# Altium schematic sheet FPGA_MISC.SchDoc
size 558 x 431 mm; SheetNumber: 8; SheetTotal: 25; Sheet_Name: FPGA MISCELLANEOUS; Size: 11x17
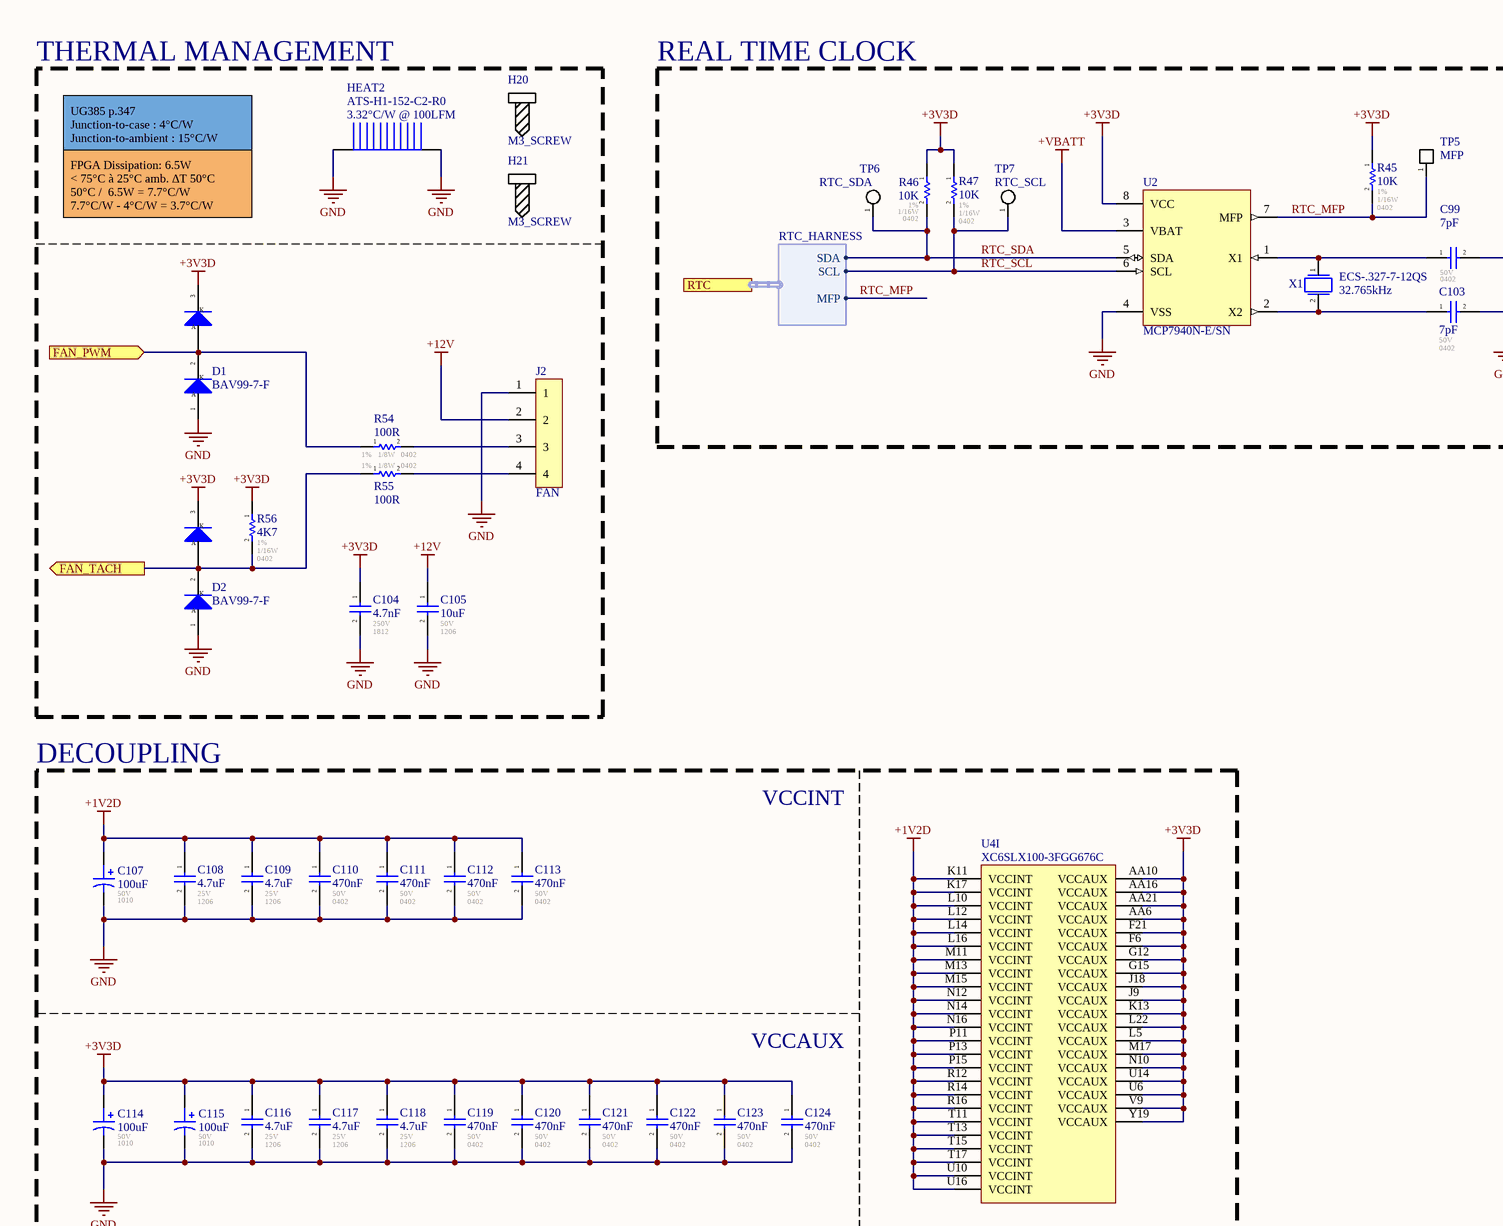
[diagram p0: FPGA_MISC.SchDoc, top left]
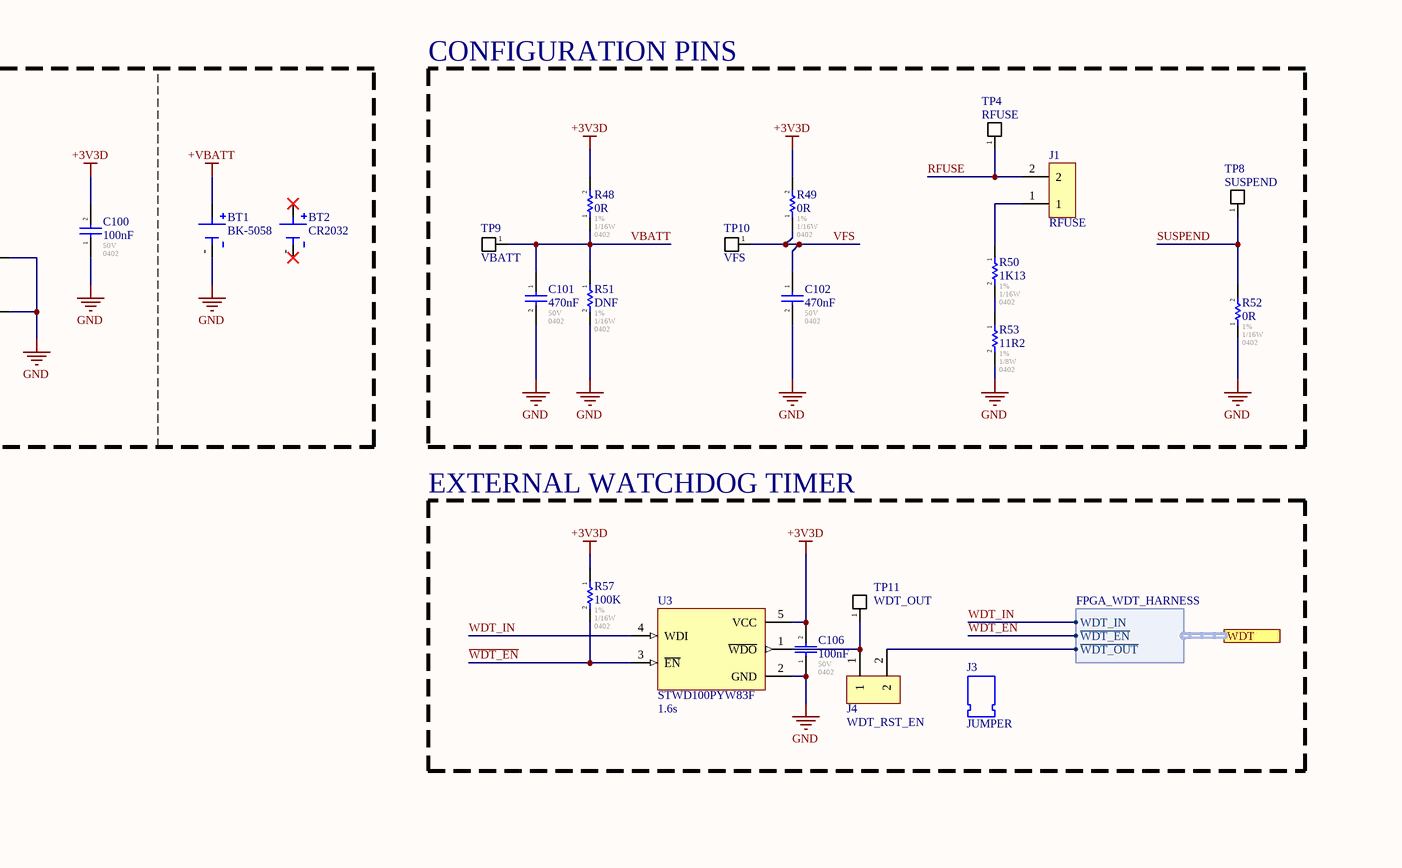
[diagram p1: FPGA_MISC.SchDoc, top right]
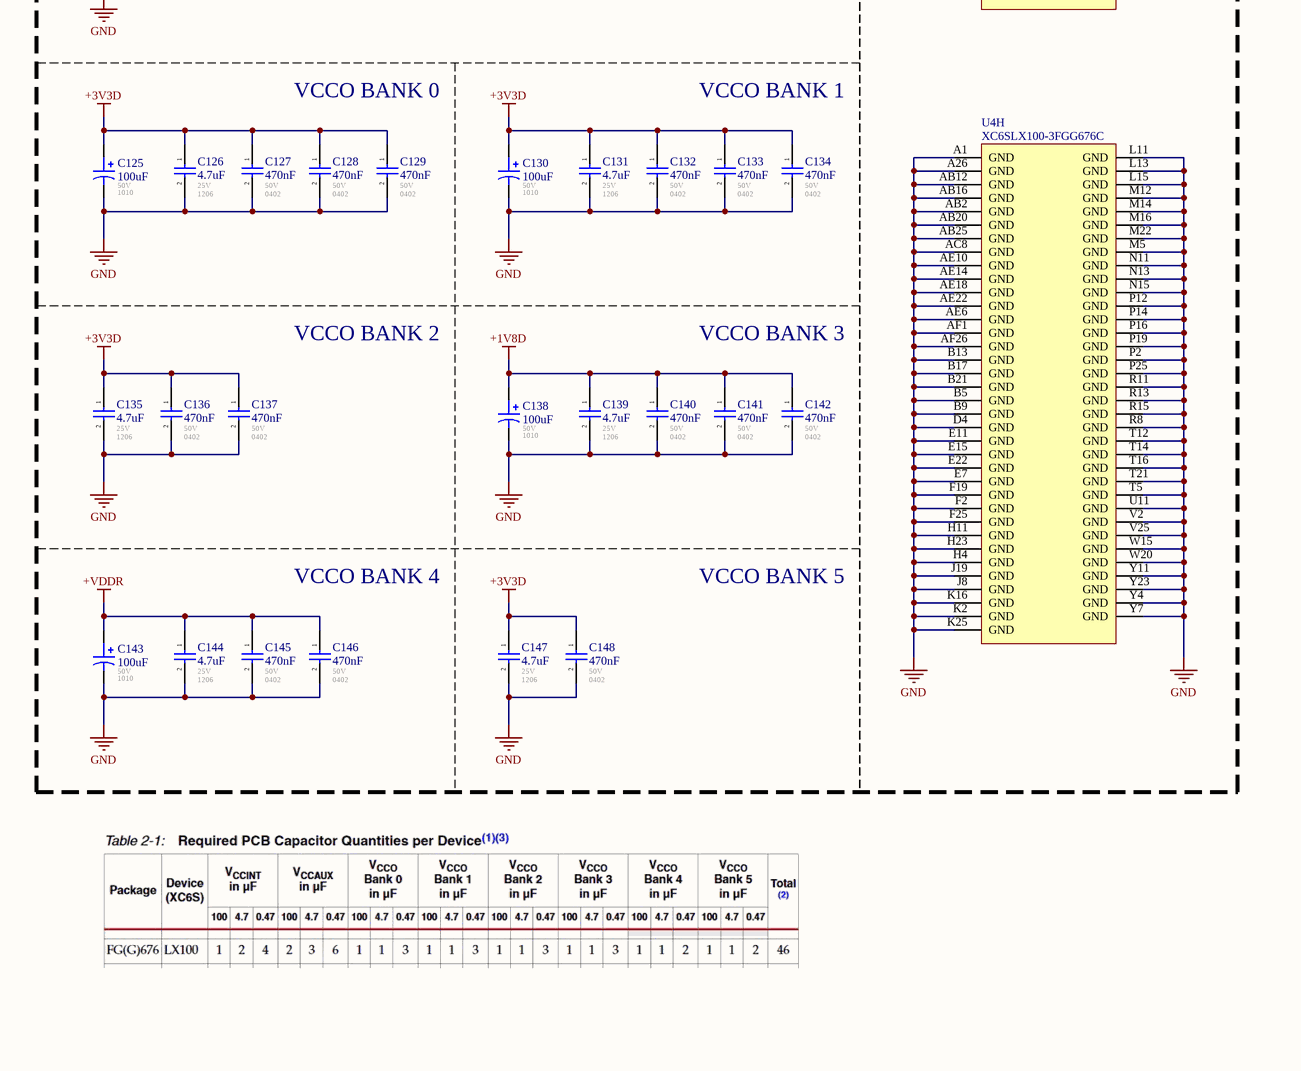
[diagram p2: FPGA_MISC.SchDoc, bottom left]
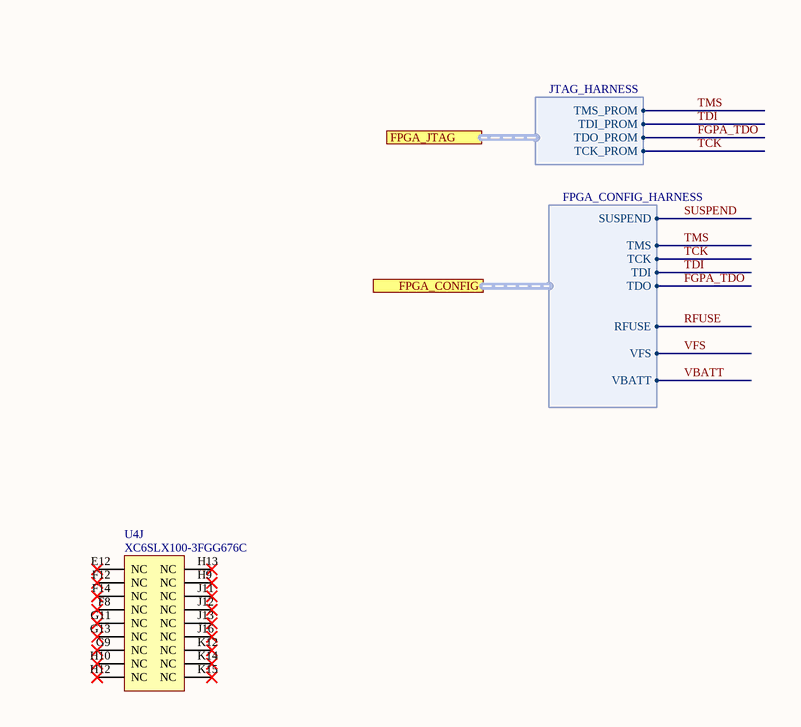
[diagram p3: FPGA_MISC.SchDoc, bottom right]

## Parts
BT1  BK-5058  [BK-5058]
BT2  CR2032  (mechanical)
C99  7pF  Voltage - Rated: 50V  Footprint: 0402  [CAP_0402]
C100  100nF  Voltage - Rated: 50V  Footprint: 0402  [CAP_0402]
C101  470nF  Voltage - Rated: 50V  Footprint: 0402  [CAP_0402]
C102  470nF  Voltage - Rated: 50V  Footprint: 0402  [CAP_0402]
C103  7pF  Voltage - Rated: 50V  Footprint: 0402  [CAP_0402]
C104  4.7nF  Voltage - Rated: 250V  Footprint: 1812  [CAP_1812]
C105  10uF  Voltage - Rated: 50V  Footprint: 1206  [CAP_1206]
C106  100nF  Voltage - Rated: 50V  Footprint: 0402  [CAP_0402]
C107  value 100uF  Voltage: 50V  Package: 1010  [CAP_ALU_1010_vishay]  (hidden comment: MAL215099101E3)
C108  4.7uF  Voltage - Rated: 25V  Footprint: 1206  [CAP_1206]
C109  4.7uF  Voltage - Rated: 25V  Footprint: 1206  [CAP_1206]
C110  470nF  Voltage - Rated: 50V  Footprint: 0402  [CAP_0402]
C111  470nF  Voltage - Rated: 50V  Footprint: 0402  [CAP_0402]
C112  470nF  Voltage - Rated: 50V  Footprint: 0402  [CAP_0402]
C113  470nF  Voltage - Rated: 50V  Footprint: 0402  [CAP_0402]
C114  value 100uF  Voltage: 50V  Package: 1010  [CAP_ALU_1010_vishay]  (hidden comment: MAL215099101E3)
C115  value 100uF  Voltage: 50V  Package: 1010  [CAP_ALU_1010_vishay]  (hidden comment: MAL215099101E3)
C116  4.7uF  Voltage - Rated: 25V  Footprint: 1206  [CAP_1206]
C117  4.7uF  Voltage - Rated: 25V  Footprint: 1206  [CAP_1206]
C118  4.7uF  Voltage - Rated: 25V  Footprint: 1206  [CAP_1206]
C119  470nF  Voltage - Rated: 50V  Footprint: 0402  [CAP_0402]
C120  470nF  Voltage - Rated: 50V  Footprint: 0402  [CAP_0402]
C121  470nF  Voltage - Rated: 50V  Footprint: 0402  [CAP_0402]
C122  470nF  Voltage - Rated: 50V  Footprint: 0402  [CAP_0402]
C123  470nF  Voltage - Rated: 50V  Footprint: 0402  [CAP_0402]
C124  470nF  Voltage - Rated: 50V  Footprint: 0402  [CAP_0402]
C125  value 100uF  Voltage: 50V  Package: 1010  [CAP_ALU_1010_vishay]  (hidden comment: MAL215099101E3)
C126  4.7uF  Voltage - Rated: 25V  Footprint: 1206  [CAP_1206]
C127  470nF  Voltage - Rated: 50V  Footprint: 0402  [CAP_0402]
C128  470nF  Voltage - Rated: 50V  Footprint: 0402  [CAP_0402]
C129  470nF  Voltage - Rated: 50V  Footprint: 0402  [CAP_0402]
C130  value 100uF  Voltage: 50V  Package: 1010  [CAP_ALU_1010_vishay]  (hidden comment: MAL215099101E3)
C131  4.7uF  Voltage - Rated: 25V  Footprint: 1206  [CAP_1206]
C132  470nF  Voltage - Rated: 50V  Footprint: 0402  [CAP_0402]
C133  470nF  Voltage - Rated: 50V  Footprint: 0402  [CAP_0402]
C134  470nF  Voltage - Rated: 50V  Footprint: 0402  [CAP_0402]
C135  4.7uF  Voltage - Rated: 25V  Footprint: 1206  [CAP_1206]
C136  470nF  Voltage - Rated: 50V  Footprint: 0402  [CAP_0402]
C137  470nF  Voltage - Rated: 50V  Footprint: 0402  [CAP_0402]
C138  value 100uF  Voltage: 50V  Package: 1010  [CAP_ALU_1010_vishay]  (hidden comment: MAL215099101E3)
C139  4.7uF  Voltage - Rated: 25V  Footprint: 1206  [CAP_1206]
C140  470nF  Voltage - Rated: 50V  Footprint: 0402  [CAP_0402]
C141  470nF  Voltage - Rated: 50V  Footprint: 0402  [CAP_0402]
C142  470nF  Voltage - Rated: 50V  Footprint: 0402  [CAP_0402]
C143  value 100uF  Voltage: 50V  Package: 1010  [CAP_ALU_1010_vishay]  (hidden comment: MAL215099101E3)
C144  4.7uF  Voltage - Rated: 25V  Footprint: 1206  [CAP_1206]
C145  470nF  Voltage - Rated: 50V  Footprint: 0402  [CAP_0402]
C146  470nF  Voltage - Rated: 50V  Footprint: 0402  [CAP_0402]
C147  4.7uF  Voltage - Rated: 25V  Footprint: 1206  [CAP_1206]
C148  470nF  Voltage - Rated: 50V  Footprint: 0402  [CAP_0402]
D1  BAV99-7-F  [SOT23-3]
D2  BAV99-7-F  [SOT23-3]
H20  M3_SCREW  (mechanical)
H21  M3_SCREW  (mechanical)
HEAT2  ATS-H1-152-C2-R0  Thermal Resistance: 3.32°C/W @ 100LFM  [ATS-H1-152-C2-R0]
J1  RFUSE  [HEADER-2_100MIL]
J2  FAN  [FAN_HEADER-4]
J3  JUMPER  (mechanical)
J4  WDT_RST_EN  [HEADER-2_100MIL]
R45  10K  Tolerance: 1%  Power: 1/16W  Package / Case: 0402  [RES_0402]
R46  10K  Tolerance: 1%  Power: 1/16W  Package / Case: 0402  [RES_0402]
R47  10K  Tolerance: 1%  Power: 1/16W  Package / Case: 0402  [RES_0402]
R48  0R  Tolerance: 1%  Power: 1/16W  Package / Case: 0402  [RES_0402]
R49  0R  Tolerance: 1%  Power: 1/16W  Package / Case: 0402  [RES_0402]
R50  1K13  Tolerance: 1%  Power: 1/16W  Package / Case: 0402  [RES_0402]
R51  DNF  Tolerance: 1%  Power: 1/16W  Package / Case: 0402  [RES_0402]
R52  0R  Tolerance: 1%  Power: 1/16W  Package / Case: 0402  [RES_0402]
R53  11R2  Tolerance: 1%  Power: 1/8W  Package / Case: 0402  [RES_0402]
R54  100R  Tolerance: 1%  Power: 1/8W  Package / Case: 0402  [RES_0402]
R55  100R  Tolerance: 1%  Power: 1/8W  Package / Case: 0402  [RES_0402]
R56  4K7  Tolerance: 1%  Power: 1/16W  Package / Case: 0402  [RES_0402]
R57  100K  Tolerance: 1%  Power: 1/16W  Package / Case: 0402  [RES_0402]
TP4  RFUSE  [TP_PAD]  (no BOM)
TP5  MFP  [TP_PAD]  (no BOM)
TP6  RTC_SDA  [TP_PAD_SMALL]  (no BOM)
TP7  RTC_SCL  [TP_PAD_SMALL]  (no BOM)
TP8  SUSPEND  [TP_PAD]  (no BOM)
TP9  VBATT  [TP_PAD]  (no BOM)
TP10  VFS  [TP_PAD]  (no BOM)
TP11  WDT_OUT  [TP_PAD]  (no BOM)
U2  MCP7940N-E/SN  [SOIC-8_3.8mm]
U3  STWD100PYW83F  Reset Timeout: 1.6s  [SOT23-5]
U4  XC6SLX100-3FGG676C  [FPGA_XILINX_FGG676]  (parts H,I,J of 10)
X1  ECS-.327-7-12QS  Frequency: 32.765kHz  [ECX-12Q-2MMx1.2MM]

## Blocks framed on the sheet
THERMAL MANAGEMENT: C104 C105 D1 D2 H20 H21 HEAT2 J2 R54-R56
REAL TIME CLOCK: BT1 BT2 C99 C100 C103 R45-R47 TP5-TP7 U2 X1
CONFIGURATION PINS: C101 C102 J1 R48-R53 TP4 TP8-TP10
EXTERNAL WATCHDOG TIMER: C106 J3 J4 R57 TP11 U3
DECOUPLING: C107-C148 U4

## Ports
FAN_PWM (in), FAN_TACH (out), FPGA_CONFIG (harness FPGA_CONFIG_HARNESS), FPGA_JTAG (harness JTAG_HARNESS), RTC (harness RTC_HARNESS), WDT (harness FPGA_WDT_HARNESS)

## Harnesses
FPGA_CONFIG_HARNESS: TCK, TDO, TDI, SUSPEND, TMS, RFUSE, VFS, VBATT
FPGA_WDT_HARNESS: WDT_IN, ~{WDT_EN}, ~{WDT_OUT}
JTAG_HARNESS: TCK_PROM, TDO_PROM, TDI_PROM, TMS_PROM
RTC_HARNESS: SDA, SCL, MFP

## Nets
+1V2D: C107.1 C108.1 C109.1 C110.1 C111.1 C112.1 C113.1 U4.K11(VCCINT) U4.K17(VCCINT) U4.L10(VCCINT) U4.L12(VCCINT) U4.L14(VCCINT) U4.L16(VCCINT) U4.M11(VCCINT) U4.M13(VCCINT) U4.M15(VCCINT) U4.N12(VCCINT) U4.N14(VCCINT) U4.N16(VCCINT) U4.P11(VCCINT) U4.P13(VCCINT) U4.P15(VCCINT) U4.R12(VCCINT) U4.R14(VCCINT) U4.R16(VCCINT) U4.T11(VCCINT) U4.T13(VCCINT) U4.T15(VCCINT) U4.T17(VCCINT) U4.U10(VCCINT) U4.U16(VCCINT)
+1V8D: C138.1 C139.1 C140.1 C141.1 C142.1
+3V3D: C100.2 C104.1 C106.2 C114.1 C115.1 C116.1 C117.1 C118.1 C119.1 C120.1 C121.1 C122.1 C123.1 C124.1 C125.1 C126.1 C127.1 C128.1 C129.1 C130.1 C131.1 C132.1 C133.1 C134.1 C135.1 C136.1 C137.1 C147.1 C148.1 D1.3(K) D2.3(K) R45.1 R46.1 R47.1 R48.2 R49.2 R56.1 R57.1 U2.8(VCC) U3.5(VCC) U4.AA6(VCCAUX) U4.AA10(VCCAUX) U4.AA16(VCCAUX) U4.AA21(VCCAUX) U4.F6(VCCAUX) U4.F21(VCCAUX) U4.G12(VCCAUX) U4.G15(VCCAUX) U4.J9(VCCAUX) U4.J18(VCCAUX) U4.K13(VCCAUX) U4.L5(VCCAUX) U4.L22(VCCAUX) U4.M17(VCCAUX) U4.N10(VCCAUX) U4.U6(VCCAUX) U4.U14(VCCAUX) U4.V9(VCCAUX) U4.Y19(VCCAUX)
+12V: C105.1 J2.2
+VBATT: BT1.+ U2.3(VBAT)
+VDDR: C143.1 C144.1 C145.1 C146.1
GND: BT1.- C99.2 C100.1 C101.2 C102.2 C103.2 C104.2 C105.2 C106.1 C107.2 C108.2 C109.2 C110.2 C111.2 C112.2 C113.2 C114.2 C115.2 C116.2 C117.2 C118.2 C119.2 C120.2 C121.2 C122.2 C123.2 C124.2 C125.2 C126.2 C127.2 C128.2 C129.2 C130.2 C131.2 C132.2 C133.2 C134.2 C135.2 C136.2 C137.2 C138.2 C139.2 C140.2 C141.2 C142.2 C143.2 C144.2 C145.2 C146.2 C147.2 C148.2 D1.1(A) D2.1(A) HEAT2.1 HEAT2.2 J2.1 R51.2 R52.1 R53.2 U2.4(VSS) U3.2(GND) U4.A1(GND) U4.A26(GND) U4.AB2(GND) U4.AB12(GND) U4.AB16(GND) U4.AB20(GND) U4.AB25(GND) U4.AC8(GND) U4.AE6(GND) U4.AE10(GND) U4.AE14(GND) U4.AE18(GND) U4.AE22(GND) U4.AF1(GND) U4.AF26(GND) U4.B5(GND) U4.B9(GND) U4.B13(GND) U4.B17(GND) U4.B21(GND) U4.D4(GND) U4.E7(GND) U4.E11(GND) U4.E15(GND) U4.E22(GND) U4.F2(GND) U4.F19(GND) U4.F25(GND) U4.H4(GND) U4.H11(GND) U4.H23(GND) U4.J8(GND) U4.J19(GND) U4.K2(GND) U4.K16(GND) U4.K25(GND) U4.L11(GND) U4.L13(GND) U4.L15(GND) U4.M5(GND) U4.M12(GND) U4.M14(GND) U4.M16(GND) U4.M22(GND) U4.N11(GND) U4.N13(GND) U4.N15(GND) U4.P2(GND) U4.P12(GND) U4.P14(GND) U4.P16(GND) U4.P19(GND) U4.P25(GND) U4.R8(GND) U4.R11(GND) U4.R13(GND) U4.R15(GND) U4.T5(GND) U4.T12(GND) U4.T14(GND) U4.T16(GND) U4.T21(GND) U4.U11(GND) U4.V2(GND) U4.V25(GND) U4.W15(GND) U4.W20(GND) U4.Y4(GND) U4.Y7(GND) U4.Y11(GND) U4.Y23(GND)
~{WDT_EN}: R57.2 U3.3(~{EN}) ; port WDT.~{WDT_EN}
FAN_PWM: D1.2(K) R54.1 ; port FAN_PWM
FAN_TACH: D2.2(K) R55.1 R56.2 ; port FAN_TACH
FGPA_TDO: port FPGA_CONFIG.TDO, port FPGA_JTAG.TDO_PROM
RFUSE: J1.2 TP4.1(A) ; port FPGA_CONFIG.RFUSE
RTC_MFP: R45.2 TP5.1(A) U2.7(MFP) ; port RTC.MFP
RTC_SCL: R47.2 TP7.1(A) U2.6(SCL) ; port RTC.SCL
RTC_SDA: R46.2 TP6.1(A) U2.5(SDA) ; port RTC.SDA
SUSPEND: R52.2 TP8.1(A) ; port FPGA_CONFIG.SUSPEND
TCK: port FPGA_CONFIG.TCK, port FPGA_JTAG.TCK_PROM
TDI: port FPGA_CONFIG.TDI, port FPGA_JTAG.TDI_PROM
TMS: port FPGA_CONFIG.TMS, port FPGA_JTAG.TMS_PROM
VBATT: C101.1 R48.1 R51.1 TP9.1(A) ; port FPGA_CONFIG.VBATT
VFS: C102.1 R49.1 TP10.1(A) ; port FPGA_CONFIG.VFS
WDT_IN: U3.4(WDI) ; port WDT.WDT_IN
NetC99_1: C99.1 U2.1(X1) X1.1
NetC103_1: C103.1 U2.2(X2) X1.2
NetJ1_1: J1.1 R50.1
NetJ2_3: J2.3 R54.2
NetJ2_4: J2.4 R55.2
NetJ4_1: J4.1 TP11.1(A) U3.1(~{WDO})
NetJ4_2: J4.2 ; port WDT.~{WDT_OUT}
NetR50_2: R50.2 R53.1

Not connected (* = marked no-connect by the designer): BT2 +* -*; U4 E12(NC)* F8(NC)* F12(NC)* F14(NC)* G9(NC)* G11(NC)* G13(NC)* H9(NC)* H10(NC)* H12(NC)* H13(NC)* J11(NC)* J12(NC)* J13(NC)* J16(NC)* K12(NC)* K14(NC)* K15(NC)*

## Notes on the sheet
- UG385 p.347
  Junction-to-case : 4°C/W
  Junction-to-ambient : 15°C/W
- FPGA Dissipation: 6.5W
  < 75°C à 25°C amb. ΔT 50°C
  50°C /  6.5W = 7.7°C/W
  7.7°C/W - 4°C/W = 3.7°C/W
- VCCINT
- VCCAUX
- VCCO BANK 0
- VCCO BANK 1
- VCCO BANK 2
- VCCO BANK 3
- VCCO BANK 4
- VCCO BANK 5
- Sheet Name
- Project Title
- Global Project
- Revision
- Size
- Date
- Group
- Sheet
- of
- Filename
- Designers

## Library data of the parts
BT1 = BATTERY: Battery Holder; Mfr: MPD; ComponentLink1Description: Digikey; ComponentLink1URL: https://www.digikey.com/en/products/detail/mpd-memory-protection-devices/BK-5058/2194769
BT2 = BATTERY: Mfr: *; Size: *; Capacity: *; Voltage - Max: *; Voltage - Nominal: *; Voltage - Min: *; Current - Max: *
C99 C103 = CAP_CER: 0402 7pF C0G Ceramic Capacitor / GCM1555C1H7R0BA16D; Mfr: Murata; Operating Temperature: -55C - 125C; Temperature Coefficient: C0G; ComponentLink1Description: Digikey; ComponentLink1URL: https://www.digikey.ca/en/products/detail/murata-electronics/GCM1555C1H7R0BA16D/11618476; ComponentLink2Description: Datasheet; ComponentLink2URL: https://search.murata.co.jp/Ceramy/image/img/A01X/G101/ENG/GCM1555C1H7R0BA16-01.pdf
C100 C106 = CAP_CER: GCM155R71H104KE02J / 0402 100nF 10% X7R Ceramic Capacitor; Mfr: Murata; Operating Temperature: -55C - 125C; Temperature Coefficient: X7R; ComponentLink1Description: Digikey; ComponentLink1URL: [Digikey Link]; Part#: GCM155R71H104KE02J; ComponentLink2Description: Datasheet; ComponentLink2URL: [Datasheet Link]; Tolerance: 10%; Ratings: AEC-Q200
C101 C102 C110-C113 C119-C124 C127-C129 C132-C134 C136 C137 C140-C142 C145 C146 C148 = CAP_CER: CGA3E3X7R1H474K080AB / 0603 470nF 10% X7R Ceramic Capacitor; Mfr: TDK; Operating Temperature: -55C - 125C; Temperature Coefficient: X7R; ComponentLink1Description: Digikey; ComponentLink1URL: [Digikey Link]; Part#: CGA3E3X7R1H474K080AB; ComponentLink2Description: Datasheet; ComponentLink2URL: [Datasheet Link]; Tolerance: 10%; Ratings: AEC-Q200
C104 = CAP_CER: GA343DR7GD472KW01L / 0402 4.7nF 10% X7R 1812 250VAC Ceramic Capacitor; Mfr: Murata; Ratings: Y3 - Safety; Operating Temperature: -55C - 125C; Temperature Coefficient: X7R; ComponentLink1Description: Digikey; ComponentLink1URL: https://www.digikey.ca/en/products/detail/murata-electronics/GA343DR7GD472KW01L/789292; ComponentLink2Description: Datasheet; ComponentLink2URL: https://search.murata.co.jp/Ceramy/image/img/A01X/G101/ENG/GA343DR7GD472KW01-01.pdf; ComponentLink3Description: Octopart; ComponentLink3URL: https://octopart.com/ga343dr7gd472kw01l-murata-197048?r=sp; Tolerance: 10%; Part#: GA343DR7GD472KW01L; ComponentLink4Description: Murata; ComponentLink4URL: https://www.murata.com/en-us/products/productdetail?partno=GA343DR7GD472KW01%23
C105 = CAP_CER: GRT31CR61H106KE01L / 1206 10uF 10% X5R Ceramic Capacitor; Mfr: Murata; Operating Temperature: -55C - 85C; Temperature Coefficient: X5R; ComponentLink1Description: Digikey; ComponentLink1URL: [Digikey Link]; ComponentLink2Description: Datasheet; ComponentLink2URL: [Datasheet Link]; Tolerance: 10%; Ratings: AEC-Q200; Supplier 1: Arrow Electronics; Supplier Part Number 1: GRT31CR61H106KE01L; Part#: GRT31CR61H106KE01L
C107 C114 C115 C125 C130 C138 C143 = CAP_ALU_MAL215099101E3: CAP - ALU 100uF 20% 50V - 1010; Current: 490mA; Mfg: Vishay Dale; Mfg Part Number: MAL215099101E3; HelpURL: http://www.vishay.com/docs/28395/150crz.pdf; CreatedBy: Jonathan Bouchard; Temperature: -55°C to 125°C; Power: *; Supplier 1: Digikey; Supplier Part Number 1: 4399PHDKR-ND; Precision: 20%
C108 C109 C116-C118 C126 C131 C135 C139 C144 C147 = CAP_CER: CGA8L2X7R1E475M160KA / 1812 4.7uF 20% X7R Ceramic Capacitor; Mfr: TDK; Part#: CGA9N1X7R1V476M230KC; Operating Temperature: -55C - 125C; Temperature Coefficient: X7R; ComponentLink1Description: Digikey; ComponentLink1URL: https://www.digikey.ca/en/products/detail/tdk-corporation/CGA9N1X7R1V476M230KC/15930202; ComponentLink2Description: Datasheet; ComponentLink2URL: https://product.tdk.com/system/files/dam/doc/product/capacitor/ceramic/mlcc/catalog/mlcc_automotive_general_en.pdf; Tolerance: 20%; Ratings: AEC-Q200; ComponentLink3Description: TDK; ComponentLink3URL: https://product.tdk.com/en/search/capacitor/ceramic/mlcc/info?part_no=CGA9N1X7R1V476M230KC; ComponentLink4Description: Octopart; ComponentLink4URL: https://octopart.com/cga9n1x7r1v476m230kc-tdk-122377816?r=sp; Supplier 1: Newark; Supplier Part Number 1: 57AK9414
D1 D2 = DIODE_TVS_DUAL: Diode Array 1 Pair Series Connection 75 V 300mA (DC) Surface Mount TO-236-3, SC-59, SOT-23-3; Mfr: Diodes Incorporated; Voltage - DC Reverse: 75V; Voltage - Forward: 1.25V @ 150mA; Reverse Recovery Time: 4ns; Capacitance: 2pF; Current - Reverse Leakage: 2.5µA @ 75V; Operating Temperature: -65C - 150C; Package / Case: SOT-23-3; Current: 300mA; ComponentLink1Description: Digikey; ComponentLink1URL: https://www.digikey.ca/en/products/detail/diodes-incorporated/BAV99-7-F/815018; ComponentLink2Description: Datasheet; ComponentLink2URL: https://www.diodes.com/assets/Datasheets/BAV99.pdf; ComponentLink3Description: Octopart; ComponentLink3URL: https://octopart.com/bav99-7-f-diodes+inc.-326328; Supplier 1: Future Electronics; Supplier Part Number 1: 3851920
HEAT2 = HEATSINK_ATS-H1-152-C2-R0: Heatsink Aluminium; Mfr: Advanced Thermal Solutions Inc.; Hole Size: 3mm; Hole-to-hole: 56,5685mm; Fin Height: 35mm; Length: 35; Width: 35; Material: Aluminium; ComponentLink1Description: Digikey; ComponentLink1URL: https://www.digikey.com/en/products/detail/advanced-thermal-solutions-inc/ATS-H1-152-C2-R0/4624447; Supplier 1: Digikey; Supplier Part Number 1: ATS36354-ND; ComponentLink2Description: Mfr; ComponentLink2URL: https://www.qats.com/Online-PushPin/ATS-H1-152-C2-R0
J1 J4 = HEADER_2
J2 = HEADER_4
R45-R57 = RESISTOR: Automotive: AEC-Q200; Operating Temperature: *; # Digikey: *; ComponentLink1Description: Digikey; ComponentLink1URL: *; # Manufacturer: *
TP4 TP5 TP8-TP11 = TESTPOINT_PAD: Test Point
TP6 TP7 = TESTPOINT_PAD_SMALL: Test Point
U2 = MCP7940N-E/SN: Real Time Clock (RTC) IC Clock/Calendar 64B I2C, 2-Wire Serial 8-SOIC (0.154", 3.90mm Width); Mfr: Microchip; Qualification: AEC-Q100; Voltage - Suply: 1.8V - 5.5V; Voltage - Battery: 1.3V - 5.5V; Clock Speed: 32.768kHz; Operating Temperature: -40C - 125C; ComponentLink1Description: Digikey; ComponentLink1URL: https://www.digikey.ca/en/products/detail/microchip-technology/MCP7940N-E-SN/3872278; ComponentLink2Description: Datasheet; ComponentLink2URL: https://ww1.microchip.com/downloads/aemDocuments/documents/MPD/ProductDocuments/DataSheets/MCP7940N-Battery-Backed-I2C-RTCC-with-SRAM-20005010J.pdf; ComponentLink3Description: Mfr; ComponentLink3URL: https://www.microchip.com/en-us/product/MCP7940N; ComponentLink4Description: Octopart; ComponentLink4URL: https://octopart.com/mcp7940n-e%2Fsn-microchip-24995176?r=sp
U3 = STWD100PYW83F: WATCHDOG CIRCUIT / IC SUPERVISOR 1 CHANNEL SOT23-5; Mfr: ST; Qualification: AEC-Q100; ComponentLink1Description: Digikey; ComponentLink1URL: https://www.digikey.ca/en/products/detail/stmicroelectronics/STWD100PYW83F/3711383; ComponentLink2Description: Datasheet; ComponentLink2URL: https://www.st.com/content/ccc/resource/technical/document/datasheet/06/6a/b3/83/9a/c7/4f/22/CD00176077.pdf/files/CD00176077.pdf/jcr:content/translations/en.CD00176077.pdf; Supplier 1: Mouser; Supplier Part Number 1: 511-STWD100PYW83F
U4 = FPGA_XC6SLX100-3FGG676C: FPGA - XILINX SPARTAN 6 480 I/O - BGA-676; Voltage: 1.14 V ~ 1.26 V; Current: *; Power: *; Mfg: Xilinx; Mfg Part Number: XC6SLX100-3FGG676C; HelpURL: https://www.xilinx.com/support/documentation/data_sheets/ds162.pdf; CreatedBy: Jonathan Bouchard; Temperature: 0°C ~ 85°C (TJ); Value: *; Precision: *; Package: BGA-676; Supplier 1: Digikey; Supplier Part Number 1: 122-1760-ND
X1 = OSCILLATOR: 25 MHz ±30ppm Crystal 16pF 40 Ohms HC-49/US; Frequency Tolerance: 20ppm; Load Capacitance: 7pF; Operating Temperature: -40C - 125C; Rating: AEC-Q200; Type: Tuning Fork; ComponentLink1Description: Digikey; ComponentLink1URL: https://www.digikey.ca/en/products/detail/ecs-inc/ECS-327-7-12QS-TR/6821607; ComponentLink2Description: Datasheet; ComponentLink2URL: https://ecsxtal.com/store/pdf/ECX-12Q.pdf; Supplier Part Number 1: 94X0915